# Altium schematic sheet Voltage_Divider.SchDoc
size A4
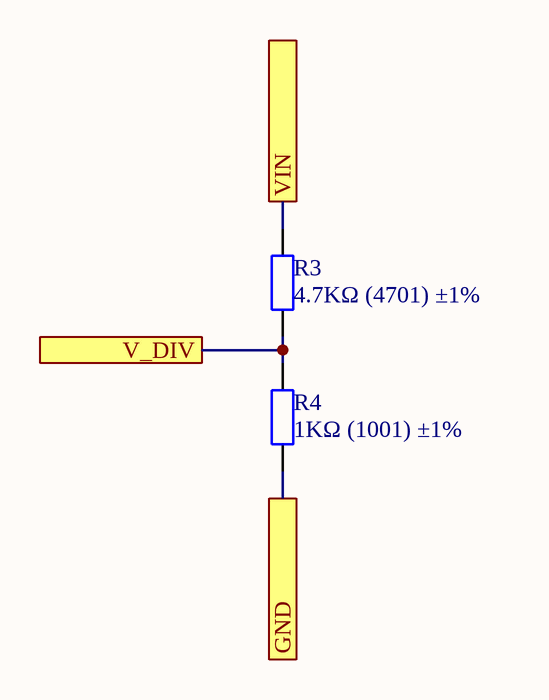
[diagram p0: Voltage_Divider.SchDoc]

## Parts
R3  4.7KΩ (4701) ±1%  [0805_R]
R4  1KΩ (1001) ±1%  [0805_R]

## Ports
GND, V_DIV, VIN

## Nets
GND: R4.1 ; port GND
V_DIV: R3.1 R4.2 ; port V_DIV
VIN: R3.2 ; port VIN

## Library data of the parts
R3 = 0805 4.7KΩ (4701) 1%: 贴片电阻; ComponentLink1Description: 供应商链接; ComponentLink1URL: http://www.szlcsc.com/product/details_18361.html; Package: 0805; Supplier: LC; SuppliersPartNumber: C17673
R4 = 0805 1KΩ (1001) 1%: 贴片电阻; ComponentLink1Description: 供应商链接; ComponentLink1URL: http://www.szlcsc.com/product/details_18201.html; Package: 0805; Supplier: LC; SuppliersPartNumber: C17513